# Altium schematic sheet [02]-BLOCK-DIAGRAMM.SchDoc: Blockdiagramm
size A3; Ingenieur: Stephan Diel; Organization: Sykam GmbH; Address1: Gewerbering 15; Address2: 86922 Eresing; Address3: Germany; Address4: https://sykam.com; DocumentNumber: 2; SheetNumber: 2; SheetTotal: 13
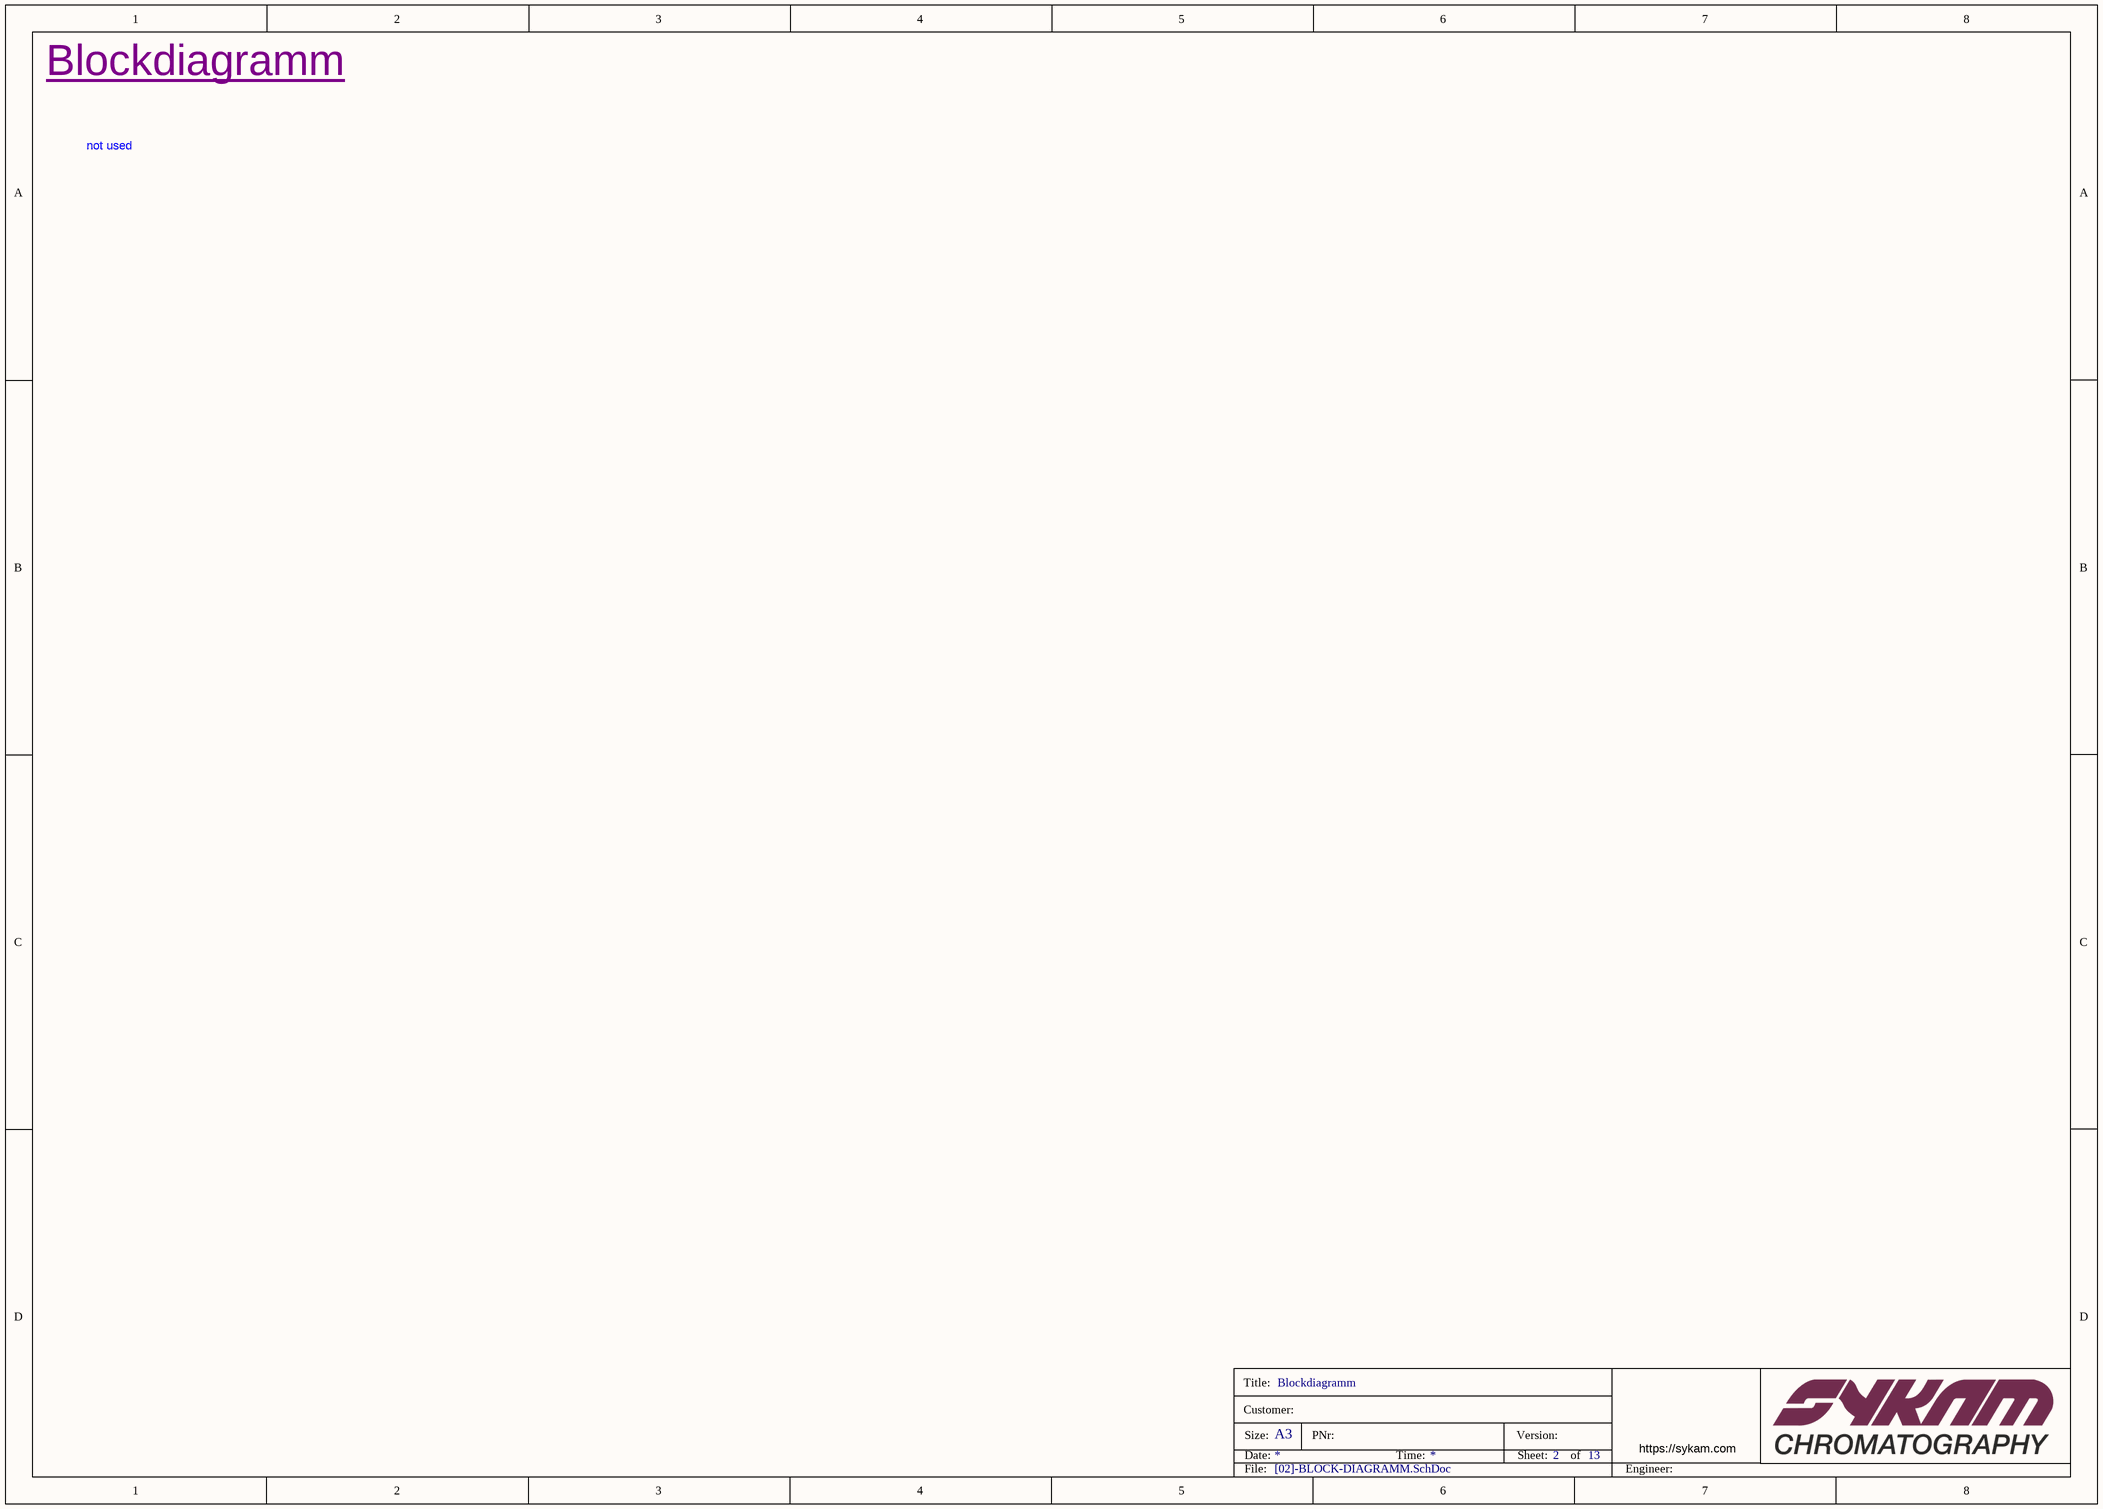
[diagram p0: [02]-BLOCK-DIAGRAMM.SchDoc]

## Notes on the sheet
- not used
- Title:
- Customer:
- Size:
- Date:
- A3
- PNr:
- Time:
- Version:
- Sheet:
- of
- File:
- Engineer: